# EAGLE design IoTKitV3th (EAGLE 9.2.0)
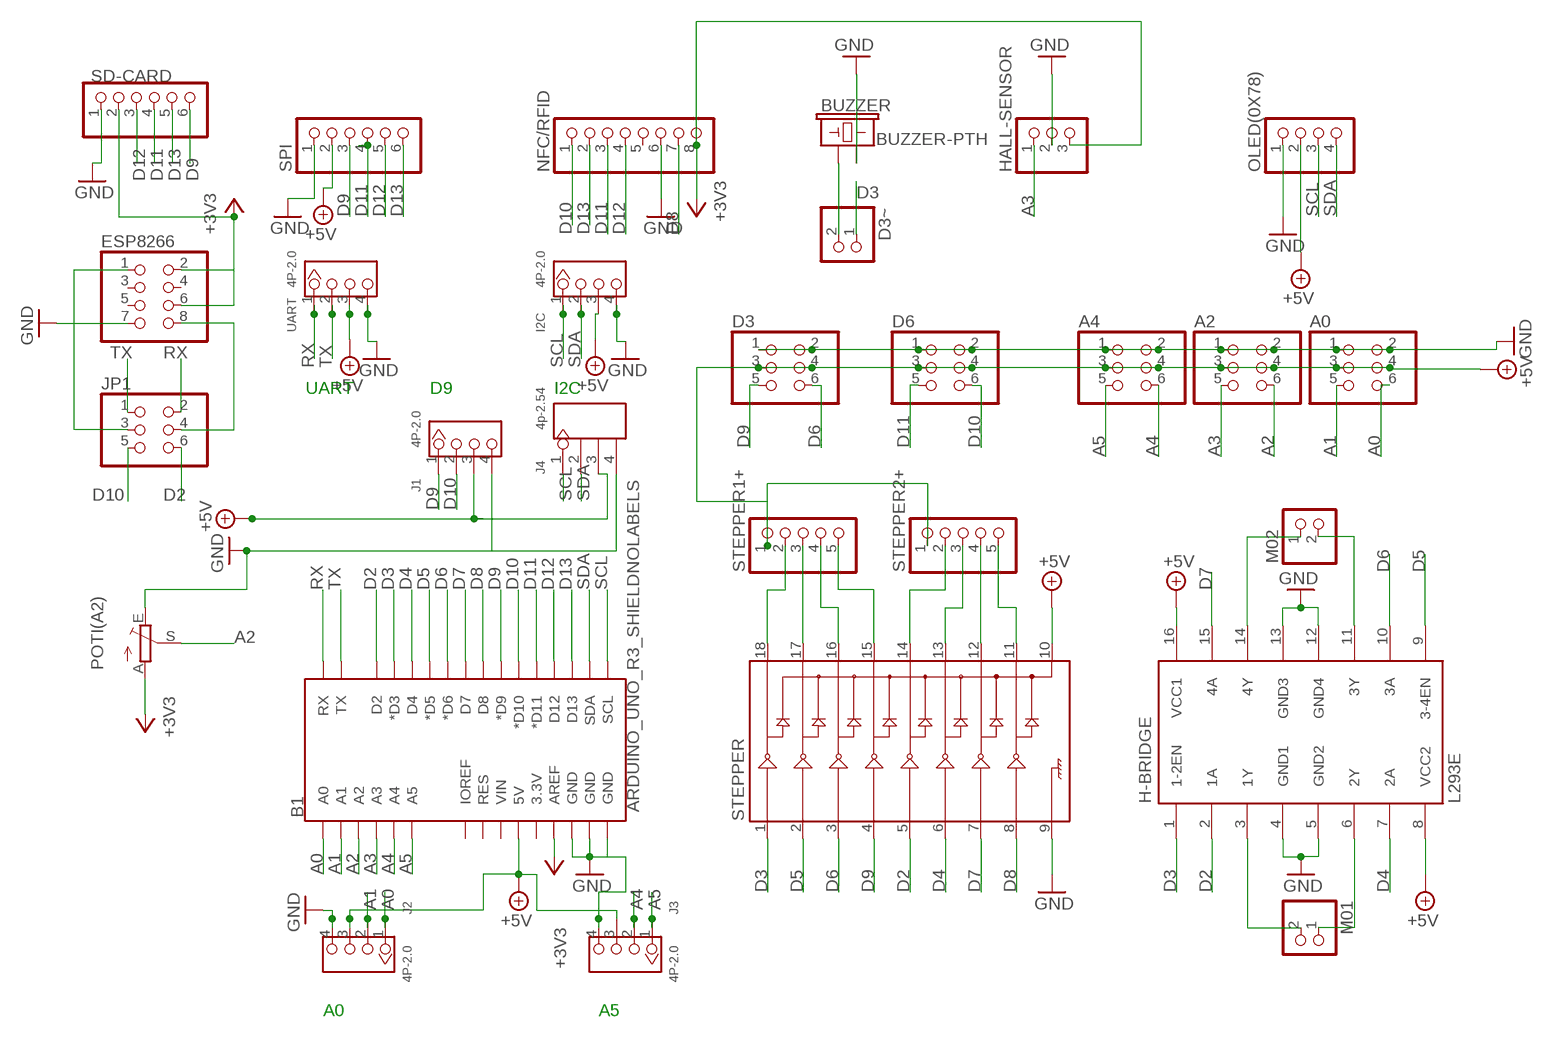
[diagram p0: schematic, sheet 1]

## Parts
A0  PINHD-2X3  [2X03]
A2  PINHD-2X3  [2X03]
A4  PINHD-2X3  [2X03]
B1  ARDUINO_UNO_R3_SHIELDNOLABELS  [UNO_R3_SHIELD_NOLABELS]
BUZZER  BUZZER-PTH  [BUZZER-12MM]
D3  PINHD-2X3  [2X03]
D3~  PINHD-1X2  [1X02]
D6  PINHD-2X3  [2X03]
ESP8266  PINHD-2X4  [2X04]
H-BRIDGE  L293E  [DIL16]
HALL-SENSOR  PINHD-1X3  [1X03]
I2C  4P-2.0  GROVE-CONNECTOR-DIP(4P-2.0)  [HW4-2.0]
J1  4P-2.0  GROVE-CONNECTOR-DIP(4P-2.0)  [HW4-2.0]
J2  4P-2.0  GROVE-CONNECTOR-DIP(4P-2.0)  [HW4-2.0]
J3  4P-2.0  GROVE-CONNECTOR-DIP(4P-2.0)  [HW4-2.0]
J4  4p-2.54  DIP-BLACK-MALE-HEADER-VERT(4P-2.54)  [H4-2.54]
JP1  PINHD-2X3  [2X03]
M01  PINHD-1X2  [1X02]
M02  PINHD-1X2  [1X02]
NFC/RFID  PINHD-1X8  [1X08]
OLED(0X78)  PINHD-1X4  [1X04]
POTI(A2)  TRIM_EU-B25P  [B25P]
SD-CARD  PINHD-1X6  [1X06]
SPI  PINHD-1X6  [1X06]
STEPPER  ULN2803DIP  [DIL18]
STEPPER1+  PINHD-1X5  [1X05]
STEPPER2+  PINHD-1X5  [1X05]
UART  4P-2.0  GROVE-CONNECTOR-DIP(4P-2.0)  [HW4-2.0]

## Nets
+3V3: B1.AREF ESP8266.2 ESP8266.6 HALL-SENSOR.3 NFC/RFID.8 POTI(A2).A SD-CARD.2
+5V: A0.3 A0.4 A2.3 A2.4 A4.3 A4.4 B1.5V D3.3 D3.4 D6.3 D6.4 H-BRIDGE.8(VCC2) H-BRIDGE.16(VCC1) I2C.3 J1.3 J2.3 J3.3 J4.3 OLED(0X78).2 SPI.2 STEPPER1+.1 STEPPER2+.1 STEPPER.10 UART.3
A0: A0.6 B1.A0 J2.1
A1: A0.5 B1.A1 J2.2
A2: A2.6 B1.A2 POTI(A2).S
A3: A2.5 B1.A3 HALL-SENSOR.1
A4: A4.6 B1.A4 J3.2
A5: A4.5 B1.A5 J3.1
D2: B1.D2 H-BRIDGE.2(1A) JP1.6 STEPPER.5
D3: B1.D3(*D3) D3~.1 H-BRIDGE.1(1-2EN) STEPPER.1
D4: B1.D4 H-BRIDGE.7(2A) STEPPER.6
D5: B1.D5(*D5) H-BRIDGE.9(3-4EN) STEPPER.2
D6: B1.D6(*D6) D3.6 H-BRIDGE.10(3A) STEPPER.3
D7: B1.D7 H-BRIDGE.15(4A) STEPPER.7
D8: B1.D8 NFC/RFID.7 STEPPER.8
D9: B1.D9(*D9) D3.5 J1.1 SD-CARD.6 SPI.3 STEPPER.4
D10: B1.D10(*D10) D6.6 J1.2 JP1.5 NFC/RFID.1
D11: B1.D11(*D11) D6.5 NFC/RFID.3 SD-CARD.4 SPI.4
D12: B1.D12 NFC/RFID.4 SD-CARD.3 SPI.5
D13: B1.D13 NFC/RFID.2 SD-CARD.5 SPI.6
GND: A0.1 A0.2 A2.1 A2.2 A4.1 A4.2 B1.GND@0(GND) B1.GND@1(GND) B1.GND@2(GND) BUZZER.- D3.1 D3.2 D6.1 D6.2 ESP8266.7 H-BRIDGE.4(GND1) H-BRIDGE.5(GND2) H-BRIDGE.12(GND4) H-BRIDGE.13(GND3) HALL-SENSOR.2 I2C.4 J1.4 J2.4 J3.4 J4.4 NFC/RFID.6 OLED(0X78).1 POTI(A2).E SD-CARD.1 SPI.1 STEPPER.9 UART.4
M01: H-BRIDGE.6(2Y) M01.1
N$1: STEPPER2+.2 STEPPER.14
N$2: STEPPER2+.3 STEPPER.13
N$3: STEPPER2+.4 STEPPER.12
N$4: STEPPER2+.5 STEPPER.11
N$5: BUZZER.+ D3~.2
N$8: ESP8266.1 JP1.3
N$9: ESP8266.8 JP1.4
N$30: STEPPER1+.2 STEPPER.18
N$31: STEPPER1+.3 STEPPER.17
N$32: STEPPER1+.4 STEPPER.16
N$33: STEPPER1+.5 STEPPER.15
N$38: H-BRIDGE.14(4Y) M02.1
N$39: H-BRIDGE.11(3Y) M02.2
N$40: H-BRIDGE.3(1Y) M01.2
RX: B1.RX JP1.2 UART.1
SCL: B1.SCL I2C.1 J4.1 OLED(0X78).3
SDA: B1.SDA I2C.2 J4.2 OLED(0X78).4
TX: B1.TX JP1.1 UART.2
Unconnected: B1.3.3V B1.IOREF B1.RES B1.VIN ESP8266.3 ESP8266.4 ESP8266.5 NFC/RFID.5

## Notes on the sheet
- UART | D9 | I2C
- A0 | A5

## Library data of the parts
A0 A2 A4 D3 D6 JP1 = pinhead:PINHD-2X3: PIN HEADER
B1 = SparkFun-Boards:ARDUINO_UNO_R3_SHIELD: Arduino R3 Shield Footprint Shield form compatible with the Arduino Uno R3. SparkFun Products: MG2639 Cellular Shield <https://www.sparkfun.com/products/13120> MIDI Shield <https://www.sparkfun.com/products/12898> R3 Stackable Headers Kit <https://www.sparkfun.com/products/11417>
BUZZER = SparkFun-Electromechanical:BUZZER: Buzzer Small round buzzers that operate around the audible 2kHz range. You can use these as speakers to create simple music or user interfaces. Variant Overview: PTH - Mini Speaker - PC Mount 12mm 2.048kHz <https://www.sparkfun.com/products/7950> PTH_KIT - Mini Speaker - PC Mount 12mm 2.048kHz <https://www.sparkfun.com/products/7950> KIT simplifies soldering by adding stop mask to one side of the pads. PTH_NO_SILK - Mini Speaker - PC Mount 12mm 2.048kHz <https://www.sparkfun.com/products/7950> No silkscreen indicator of buzzer outline. PTH_KIT_NO_SILK - Mini Speaker - PC Mount 12mm 2.048kHz <https://www.sparkfun.com/products/7950> KIT package w/o silkscreen SMD - Buzzer Audio Magnetic (CCV-084B16) SMD buzzer used on, e.g. the LilyPad Buzzer <https://www.sparkfun.com/products/8463> and RFID USB Reader <https://www.sparkfun.com/products/9963>. SMD_KIT - Buzzer Audio Magnetic (CCV-084B16) SMD Buzzer with elongated pins to make soldering easier. Used on the SparkFun Simon Says - Surface Mount Soldering Kit <https://www.sparkfun.com/products/10935>.; PROD_ID: COMP-08253; SF_SKU: COM-07950
D3~ M01 M02 = pinhead:PINHD-1X2: PIN HEADER
ESP8266 = pinhead:PINHD-2X4: PIN HEADER
H-BRIDGE = texas:L293E: TI DEVICE; MF: Arrow Electronics; MPN: L293E; OC_FARNELL: 1467711; OC_NEWARK: 89K0732
HALL-SENSOR = pinhead:PINHD-1X3: PIN HEADER
I2C J1-J3 UART = Seeed-Connector:GROVE-CONNECTOR-DIP(4P-2.0): 320110033
J4 = Seeed-Connector:DIP-BLACK-MALE-HEADER-VERT(4P-2.54): 320020017; MPN: P125-1104A0BS116A1
NFC/RFID = pinhead:PINHD-1X8: PIN HEADER
OLED(0X78) = pinhead:PINHD-1X4: PIN HEADER
POTI(A2) = pot:TRIM_EU-: POTENTIOMETER
SD-CARD SPI = pinhead:PINHD-1X6: PIN HEADER
STEPPER = SparkFun-IC-Special-Function:ULN2803: Darlington Driver(IC-07959, low stock) ULN2803 Darlington array. 500mA max per channel, 8-channel package. Spark Fun Electronics SKU : COM-00312
STEPPER1+ STEPPER2+ = pinhead:PINHD-1X5: PIN HEADER

## Board
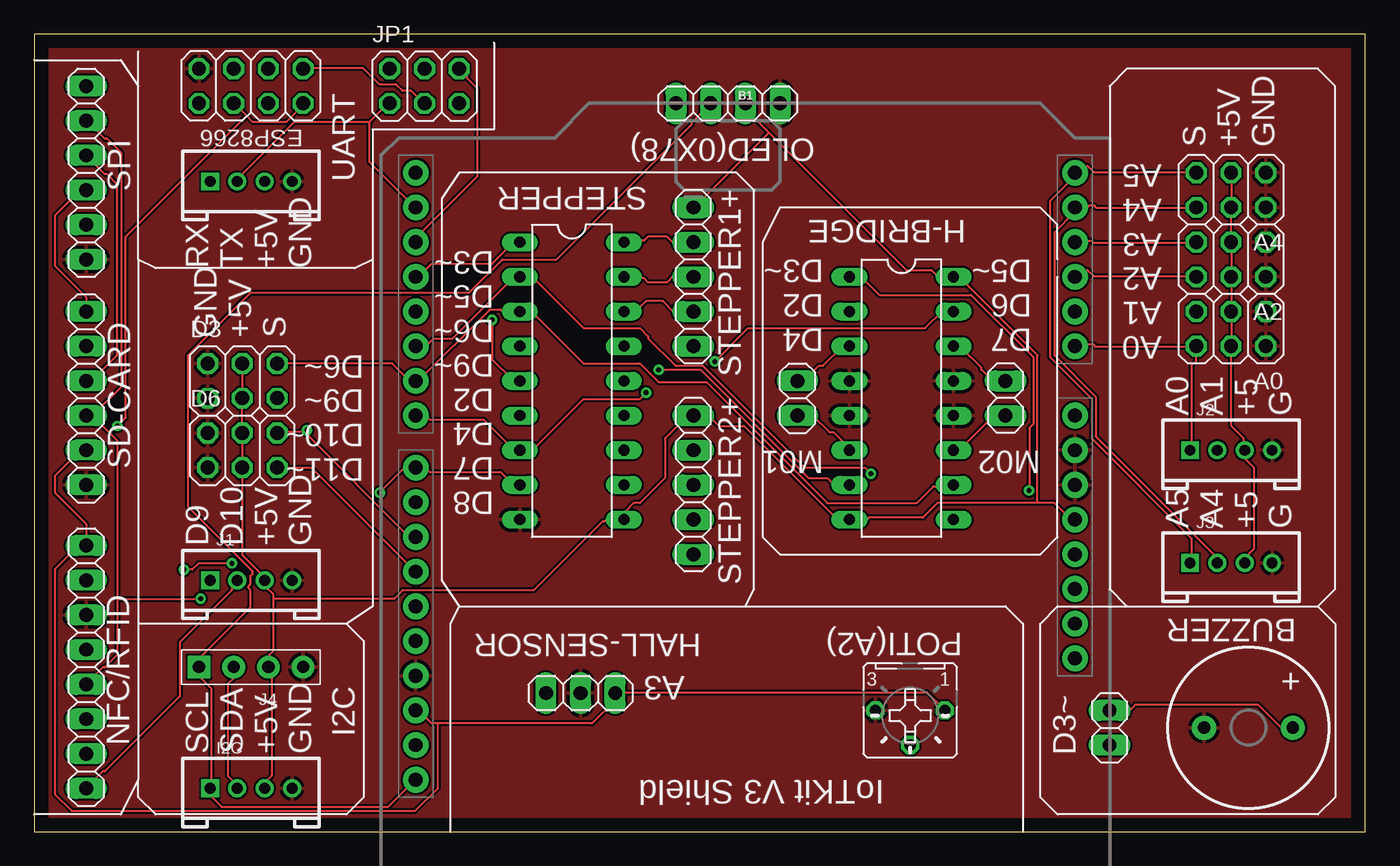
[diagram p1: board, top side]
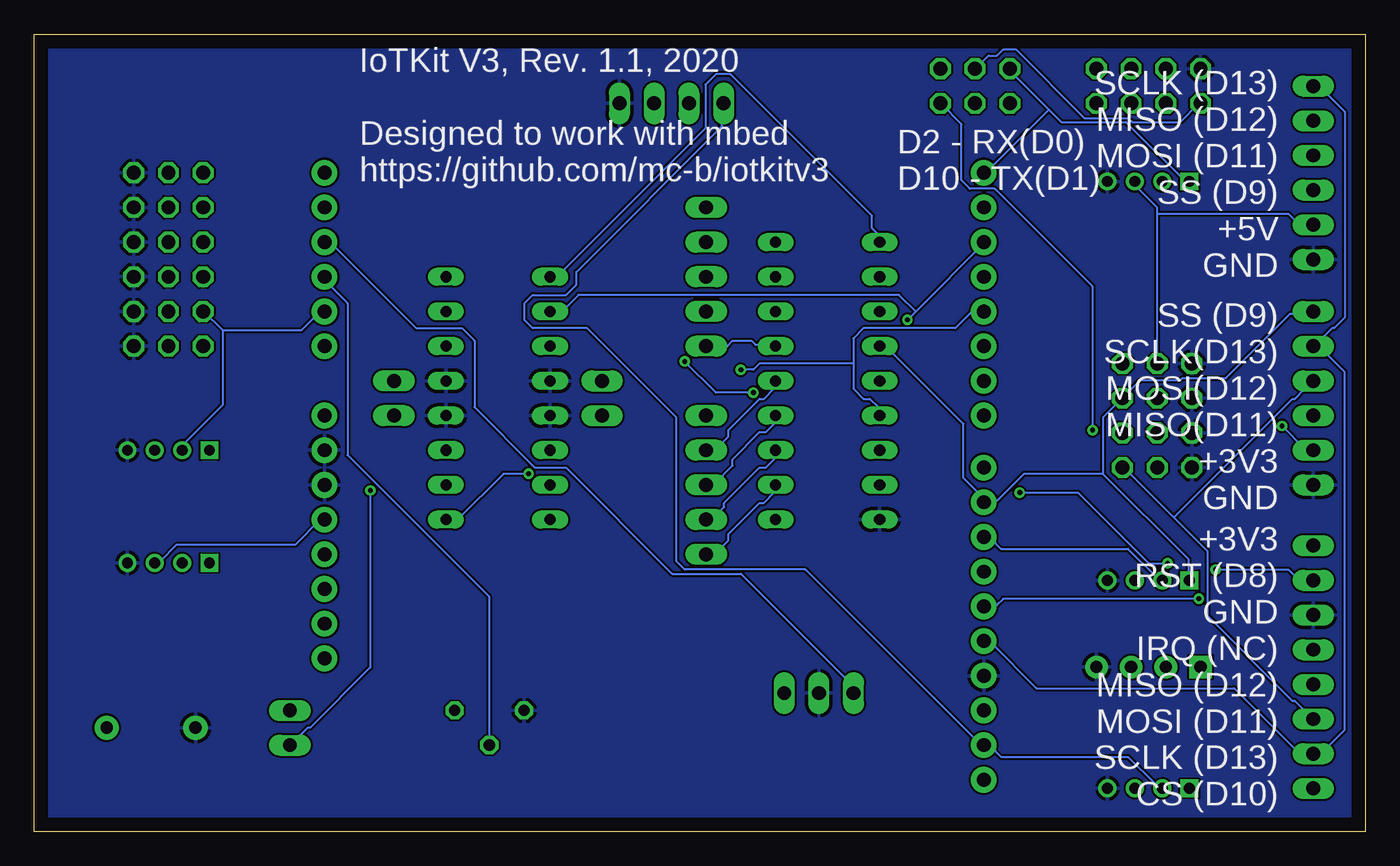
[diagram p2: board, bottom side, seen from below]

Size 97.46 x 58.41 mm. Coordinates in mm from the lower left corner, seen from the top.
Outline: 0,0 97.46,0 97.46,58.41 0,58.41 0,0
Copper layers (1*16): Top 0.035mm / dielectric 1.5mm / Bottom 0.035mm
Design rules "default": minimum track width 6mil, minimum drill 0.35mm, track to track 6mil, track to pad 6mil, pad to pad 6mil, via to via 6mil, smd to smd 6mil, copper to edge 40mil, drill to drill 6mil, minimum pad ring 10mil, minimum via ring 8mil, stop-mask expansion 4mil, vias tented up to drill 0mil, thermal gap 10mil

### Footprints (pad centres in the part's own frame; a part is rotated, then mirrored left to right if it is on the bottom)
2X03 = drill 1.016 octagon: 1 -2.54,-1.27; 2 -2.54,1.27; 3 0,-1.27; 4 0,1.27; 5 2.54,-1.27; 6 2.54,1.27
UNO_R3_SHIELD_NOLABELS = drill 1.016 pad 1.88: 3.3V 24.13,-3.81; 5V 24.13,-1.27; A0 24.13,11.43; A1 24.13,13.97; A2 24.13,16.51; A3 24.13,19.05; A4 24.13,21.59; A5 24.13,24.13; AREF -24.13,-15.24; D2 -24.13,19.05; D3 -24.13,16.51; D4 -24.13,13.97; D5 -24.13,11.43; D6 -24.13,8.89; D7 -24.13,6.35; D8 -24.13,2.54; D9 -24.13,0; D10 -24.13,-2.54; D11 -24.13,-5.08; D12 -24.13,-7.62; D13 -24.13,-10.16; GND@0 24.13,1.27; GND@1 24.13,3.81; GND@2 -24.13,-12.7; IOREF 24.13,-8.89; NC 24.13,-11.43; RES 24.13,-6.35; RX -24.13,24.13; SCL -24.13,-20.32; SDA -24.13,-17.78; TX -24.13,21.59; VIN 24.13,6.35
BUZZER-12MM = drill 0.9 pad 1.778: + 3.25,0; - -3.25,0
1X02 = drill 1.016 long: 1 -1.27,0; 2 1.27,0
2X04 = drill 1.016 octagon: 1 -3.81,-1.27; 2 -3.81,1.27; 3 -1.27,-1.27; 4 -1.27,1.27; 5 1.27,-1.27; 6 1.27,1.27; 7 3.81,-1.27; 8 3.81,1.27
DIL16 = drill 0.813 long: 1 -8.89,-3.81; 2 -6.35,-3.81; 3 -3.81,-3.81; 4 -1.27,-3.81; 5 1.27,-3.81; 6 3.81,-3.81; 7 6.35,-3.81; 8 8.89,-3.81; 9 8.89,3.81; 10 6.35,3.81; 11 3.81,3.81; 12 1.27,3.81; 13 -1.27,3.81; 14 -3.81,3.81; 15 -6.35,3.81; 16 -8.89,3.81
1X03 = drill 1.016 long: 1 -2.54,0; 2 0,0; 3 2.54,0
HW4-2.0 = drill 0.8 pad 1.27 square: 1 -3,0 | drill 0.8 pad 1.27: 2 -1,0; 3 1,0; 4 3,0
H4-2.54 = drill 0.889 pad 1.651 square: 1 0,3.81 | drill 0.889 pad 1.651: 2 0,1.27; 3 0,-1.27; 4 0,-3.81
1X08 = drill 1.016 long: 1 -8.89,0; 2 -6.35,0; 3 -3.81,0; 4 -1.27,0; 5 1.27,0; 6 3.81,0; 7 6.35,0; 8 8.89,0
1X04 = drill 1.016 long: 1 -3.81,0; 2 -1.27,0; 3 1.27,0; 4 3.81,0
B25P = drill 0.813 octagon: A -2.54,0; E 2.54,0; S 0,2.54
1X06 = drill 1.016 long: 1 -6.35,0; 2 -3.81,0; 3 -1.27,0; 4 1.27,0; 5 3.81,0; 6 6.35,0
DIL18 = drill 0.813 long: 1 -10.16,-3.81; 2 -7.62,-3.81; 3 -5.08,-3.81; 4 -2.54,-3.81; 5 0,-3.81; 6 2.54,-3.81; 7 5.08,-3.81; 8 7.62,-3.81; 9 10.16,-3.81; 10 10.16,3.81; 11 7.62,3.81; 12 5.08,3.81; 13 2.54,3.81; 14 0,3.81; 15 -2.54,3.81; 16 -5.08,3.81; 17 -7.62,3.81; 18 -10.16,3.81
1X05 = drill 1.016 long: 1 -5.08,0; 2 -2.54,0; 3 0,0; 4 2.54,0; 5 5.08,0

### Placement (x,y rotation side)
A0  87.63,36.83 180 top
A2  87.63,41.91 180 top
A4  87.63,46.99 180 top
B1  52.07,24.13 0 top
BUZZER  88.9,7.62 0 top
D3  15.24,33.02 0 top
D3~  78.74,7.62 90 top
D6  15.24,27.94 0 top
ESP8266  15.88,54.61 180 top
H-BRIDGE  63.5,31.75 270 top
HALL-SENSOR  40.01,10.16 0 top
I2C  15.88,3.17 0 top
J1  15.88,18.41 0 top
J2  87.63,27.94 0 top
J3  87.63,19.68 0 top
J4  15.88,12.06 90 top
JP1  28.57,54.61 0 top
M01  55.88,31.75 90 top
M02  71.12,31.75 270 top
NFC/RFID  3.81,12.06 90 top
OLED(0X78)  50.8,53.34 180 top
POTI(A2)  64.14,8.89 180 top
SD-CARD  3.81,31.75 90 top
SPI  3.81,48.26 90 top
STEPPER  39.37,33.02 270 top
STEPPER1+  48.26,40.64 270 top
STEPPER2+  48.26,25.4 270 top
UART  15.88,47.62 0 top

### Tracks (layer width: path | path; a pad name or v marks a point on that pad's centre or on a via)
+3V3  (via drill 0.35)
  Top 0.152: POTI(A2).A 66.6,8.99 65.38,10.21 42.67,10.21 HALL-SENSOR.3 42.52,10.06 42.52,9.6 40.84,7.92 29.57,7.92 | 29.57,7.92 29.11,7.92 28.65,8.38 28.5,8.38 28.04,8.84 B1.AREF | 15.54,52.43 16,51.97 18.44,51.97 19.81,53.34 ESP8266.2 | 15.54,52.43 14.63,53.34 ESP8266.6 | SD-CARD.2 3.81,27.89 3.35,27.89 1.52,26.06 1.52,24.84 3.81,22.55 NFC/RFID.8 3.81,20.88 3.2,20.88 1.52,19.2 1.52,2.74 2.74,1.52 27.89,1.52 29.57,3.2 29.57,7.92 | 15.54,52.43 6.71,43.59 6.71,30.33 v6.1,29.72
  Bottom 0.152: v6.1,29.72 4.42,28.04 3.81,28.04 SD-CARD.2
+5V
  Top 0.152: I2C.3 16.92,3.2 16.92,3.66 17.37,4.12 17.37,11.89 17.22,12.04 J4.3 17.22,12.19 17.22,12.95 17.53,13.26 17.53,17.07 | 17.53,17.07 17.53,17.37 16.92,17.98 16.92,18.29 J1.3 16.76,18.44 16.76,18.75 15.24,20.27 D6.3 D6.4 D3.3 D3.4 | 53.8,51.21 52.12,52.88 52.12,53.34 OLED(0X78).2 | 53.8,51.21 63.86,41.15 65.68,41.15 66.14,40.69 67.21,40.69 H-BRIDGE.16 67.36,40.54 67.82,40.54 73.46,34.9 73.46,24.08 | 53.8,51.21 48.31,45.72 STEPPER1+.1 | A4.3 A4.4 A2.3 A2.4 A0.3 A0.4 87.63,29.72 88.54,28.8 88.54,28.04 J2.3 88.7,27.89 88.7,27.28 89.31,26.67 89.31,20.73 88.7,20.12 88.7,19.81 J3.3 | 73.46,24.08 74.68,24.08 75.89,22.86 B1.5V | 73.46,24.08 66.14,24.08 65.08,23.01 61.11,23.01 60.96,22.86 H-BRIDGE.8 58.83,22.86 51.97,29.72 50.14,29.72 49.38,30.48 STEPPER2+.1 47.85,30.48 46.18,28.8 46.18,25.91 44.35,24.08 43.89,24.08 43.28,23.47 43.28,22.86 STEPPER.10 41.91,22.86 41.76,22.71 41.6,22.71 36.58,17.68 26.98,17.68 26.36,17.07 17.53,17.07
  Bottom 0.152: D3.4 15.24,45.26 | 15.24,45.26 15.24,45.72 16.76,47.24 16.76,47.55 UART.3 | 15.24,45.26 5.64,45.26 4.88,44.5 3.81,44.5 SPI.2 | B1.5V 76.5,22.86 78.33,21.03 87.02,21.03 88.24,19.81 88.54,19.81 J3.3
A0
  Top 0.152: 85.04,35.51 85.04,34.44 84.73,34.14 84.73,28.04 J2.1 | 85.04,35.51 77.72,35.51 77.57,35.66 76.2,35.66 B1.A0 | 85.04,35.51 A0.6
A1
  Bottom 0.152: 83.67,36.73 83.67,31.24 86.56,28.35 86.56,28.04 J2.2 | 83.67,36.73 85.04,38.1 A0.5 | B1.A1 76.5,38.1 77.88,36.73 83.67,36.73
A2
  Top 0.152: A2.6 85.04,40.69 77.57,40.69 77.11,41.15 76.66,40.69 76.2,40.69 B1.A2
  Bottom 0.152: B1.A2 76.2,40.39 74.52,38.71 74.52,27.58 64.16,17.22 64.16,6.4 POTI(A2).S
A3
  Top 0.152: A2.5 85.04,43.13 77.57,43.13 77.42,43.28 76.2,43.28 B1.A3
  Bottom 0.152: HALL-SENSOR.1 37.49,10.21 37.49,10.67 45.72,18.9 50.75,18.9 58.52,26.67 60.81,26.67 65.23,31.09 65.23,35.97 66.14,36.88 69.49,36.88 75.74,43.13 76.2,43.13 B1.A3
A4
  Top 0.152: J3.2 86.56,19.81 86.56,20.12 77.72,28.96 77.72,31.85 74.68,34.9 74.68,43.89 76.2,45.41 B1.A4 77.11,45.72 77.27,45.87 77.57,45.87 77.72,45.72 A4.6
A5
  Top 0.152: J3.1 84.73,19.81 84.73,21.49 77.42,28.8 77.42,31.7 74.37,34.75 74.37,46.18 76.2,48.01 B1.A5 76.2,48.31 76.66,48.31 77.11,48.77 77.57,48.31 85.04,48.31 A4.5
D2  (via drill 0.35)
  Top 0.152: v33.53,37.49 33.53,34.59 35.05,33.07 35.51,33.07 STEPPER.5 | JP1.6 31.24,55.78 31.7,55.32 31.7,55.17 32.46,54.41 32.46,48.01 28.04,43.59 28.04,43.28 B1.D2
  Bottom 0.152: 32.92,38.1 27.89,43.13 B1.D2 | 32.92,38.1 v33.53,37.49 | H-BRIDGE.2 58.83,38.1 57.61,39.32 34.14,39.32 32.92,38.1
D3  (via drill 0.35)
  Top 0.152: STEPPER.1 35.51,43.13 35.05,43.13 33.53,41.6 29.11,41.6 28.04,40.54 B1.D3 | v72.85,24.99 72.85,29.57 73.15,29.87 73.15,34.75 68.58,39.32 61.87,39.32 60.66,40.54 59.74,40.54 H-BRIDGE.1
  Bottom 0.152: H-BRIDGE.1 59.59,40.69 59.13,40.69 48.31,51.51 48.31,54.71 47.55,55.47 46.48,55.47 36.12,45.11 36.12,44.2 35.66,43.74 35.66,43.28 STEPPER.1 | v72.85,24.99 72.85,12.04 77.27,7.62 77.42,7.62 78.64,6.4 D3~.1
D4  (via drill 0.35)
  Top 0.152: v45.72,33.83 48.77,33.83 56.69,25.91 58.06,25.91 58.52,25.45 59.59,25.45 H-BRIDGE.7
  Bottom 0.152: 37.49,34.29 37.49,36.12 36.73,36.88 30.02,36.88 28.8,38.1 B1.D4 | 37.49,34.29 37.49,32.46 36.73,31.7 36.27,31.7 35.66,31.09 35.66,30.48 STEPPER.6 | v45.72,33.83 44.81,33.83 44.35,34.29 37.49,34.29
D5  (via drill 0.35)
  Top 0.152: B1.D5 28.04,35.66 28.8,35.66 29.26,36.12 30.63,36.12 35.05,40.54 35.51,40.54 STEPPER.2 35.66,40.54 36.58,40.54 40.23,36.88 44.35,36.88 44.96,36.27 44.96,36.12 46.94,34.14 48.92,34.14 56.39,26.67 60.81,26.67 v61.27,26.21
  Bottom 0.152: H-BRIDGE.9 66.45,22.86 63.09,26.21 v61.27,26.21
D6
  Top 0.152: H-BRIDGE.10 67.21,25.3 65.84,25.3 64.62,24.08 58.06,24.08 49.23,32.92 45.72,32.92 44.35,34.29 40.23,34.29 36.42,38.1 STEPPER.3 34.29,38.1 34.14,38.25 33.38,38.25 28.04,32.92 B1.D6 27.89,33.07 27.43,33.07 26.21,34.29 D3.6
D7  (via drill 0.35)
  Top 0.152: B1.D7 28.65,30.48 28.96,30.18 32.92,30.18 35.05,28.04 35.51,28.04 STEPPER.7 35.66,28.04 36.58,28.04 40.23,31.7 44.35,31.7 v44.81,32.16 | H-BRIDGE.15 66.45,38.1 65.23,36.88 52.27,36.88 v49.84,34.44
  Bottom 0.152: v49.84,34.44 47.55,32.16 v44.81,32.16
D8  (via drill 0.35)
  Top 0.152: STEPPER.8 35.51,25.45 35.05,25.45 34.14,26.36 28.96,26.36 28.65,26.67 B1.D8 27.13,26.67 v25.3,24.84 | v10.97,19.2 11.58,19.2 12.04,19.66 v14.48,19.66
  Bottom 0.152: v10.97,19.2 5.64,19.2 4.88,18.44 3.81,18.44 NFC/RFID.7 | v14.48,19.66 15.85,19.66 21.03,24.84 v25.3,24.84
D9
  Top 0.152: SD-CARD.6 3.81,39.17 1.52,41.45 1.52,45.11 3.35,46.94 3.81,46.94 SPI.3
  Bottom 0.152: STEPPER.4 35.51,35.51 35.05,35.51 29.41,29.87 29.41,25.91 28.04,24.54 28.04,24.23 B1.D9 27.89,24.23 26.98,24.23 24.99,26.21 19.2,26.21 | 19.2,26.21 12.95,19.96 12.95,18.44 J1.1 | 19.2,26.21 19.2,30.33 D3.5 16.46,33.07 13.56,33.07 13.41,33.22 10.21,33.22 5.49,37.95 5.33,37.95 5.18,38.1 SD-CARD.6
D10  (via drill 0.35)
  Top 0.152: NFC/RFID.1 3.81,3.2 5.03,4.42 5.18,4.42 10.67,9.91 10.67,13.87 14.48,17.68 14.48,17.83 14.94,18.29 J1.2 | 19.81,29.26 17.83,29.26 D6.6 | 19.81,29.26 27.43,21.64 27.89,21.64 B1.D10 | 19.81,29.26 v19.96,29.41
  Bottom 0.152: J1.2 14.94,18.44 15.24,18.75 15.39,18.75 17.37,20.73 26.67,20.73 27.43,21.49 27.89,21.49 B1.D10 | v19.96,29.41 19.96,39.93 27.13,47.09 28.96,47.09 29.57,47.7 29.57,51.82 31.09,53.34 JP1.5
D11
  Top 0.152: SPI.4 5.18,48.16 5.33,48.16 6.1,47.4 6.1,34.9 4.27,33.07 3.81,33.07 SD-CARD.4 | D6.5 20.27,26.67 27.89,19.05 B1.D11
  Bottom 0.152: 14.02,23.01 17.68,26.67 D6.5 | 14.02,23.01 11.58,20.57 11.58,15.85 5.33,9.6 5.18,9.6 4.42,8.84 4.27,8.84 3.81,8.38 NFC/RFID.3 | 14.02,23.01 5.33,31.7 5.18,31.7 4.42,32.46 4.27,32.46 3.81,32.92 SD-CARD.4
D12  (via drill 0.35)
  Top 0.152: 6.1,17.07 6.1,28.65 4.27,30.48 | 6.1,17.07 6.1,12.95 5.18,12.04 5.03,12.04 3.81,10.82 NFC/RFID.4 | 4.27,30.48 6.4,32.61 6.4,49.68 5.33,50.75 5.18,50.75 4.42,51.51 4.27,51.51 3.81,51.97 SPI.5 | 4.27,30.48 SD-CARD.3 | 6.1,17.07 v12.19,17.07
  Bottom 0.152: v12.19,17.07 26.52,17.07 26.98,16.61 27.89,16.61 B1.D12
D13
  Bottom 0.152: 3.66,35.81 3.35,36.12 3.2,36.12 2.44,36.88 2.29,36.88 1.52,37.64 1.52,52.73 3.35,54.56 3.81,54.56 SPI.6 | 3.66,35.81 3.81,35.66 SD-CARD.5 3.66,35.81 | 3.81,5.79 4.88,5.79 9.6,10.52 24.08,10.52 27.43,13.87 27.89,13.87 B1.D13 | 3.66,35.81 1.52,33.68 1.52,7.47 3.2,5.79 3.81,5.79 | 3.81,5.79 NFC/RFID.2
GND
  pour Bottom: -0.64,59.05 -0.64,-1.27 98.42,-1.27 98.42,59.05
  pour Top: -1.27,59.69 -1.27,-1.91 99.69,-1.91 99.69,59.05 99.06,59.69 -0.64,59.69
M01
  Top 0.152: H-BRIDGE.6 59.13,28.5 59.13,28.65 58.52,29.26 58.22,29.26 57,30.48 M01.1
N$1
  Bottom 0.152: STEPPER.14 43.28,32.92 43.28,32.46 44.04,31.7 44.35,31.7 46.63,29.41 46.63,28.96 47.55,28.04 48.16,28.04 STEPPER2+.2
N$2
  Bottom 0.152: STEPPER.13 43.28,30.48 43.28,29.87 43.89,29.26 44.35,29.26 46.33,27.28 46.33,26.82 47.7,25.45 48.16,25.45 STEPPER2+.3
N$3
  Bottom 0.152: STEPPER2+.4 47.85,22.86 46.94,23.77 46.94,24.08 44.35,26.67 43.89,26.67 43.28,27.28 43.28,27.89 STEPPER.12
N$4
  Bottom 0.152: STEPPER.11 43.28,25.3 43.28,24.84 44.04,24.08 44.35,24.08 46.63,21.79 46.63,21.34 47.55,20.42 48.16,20.42 STEPPER2+.5
N$5
  Top 0.152: BUZZER.+ 91.29,7.62 89.61,9.3 80.62,9.3 80.31,8.99 78.79,8.99 D3~.2
N$8
  Top 0.152: ESP8266.1 19.81,55.93 24.08,55.93 25.3,54.71 26.52,54.71 26.98,54.25 27.58,54.25 28.5,53.34 JP1.3
N$9
  Bottom 0.152: ESP8266.8 12.19,53.34 13.56,51.97 17.07,51.97 17.37,52.27 20.57,52.27 25.6,57.3 26.52,57.3 26.98,56.84 27.58,56.84 28.5,55.93 JP1.4
N$30
  Top 0.152: STEPPER.18 43.28,43.28 44.65,43.28 44.96,43.59 46.33,43.59 46.79,43.13 48.16,43.13 STEPPER1+.2
N$31
  Top 0.152: STEPPER.17 43.28,40.54 44.65,40.54 44.96,40.23 46.33,40.23 46.79,40.69 48.16,40.69 STEPPER1+.3
N$32
  Top 0.152: STEPPER.16 44.04,38.1 44.81,38.86 46.02,38.86 46.79,38.1 STEPPER1+.4
N$33
  Bottom 0.152: STEPPER.15 43.28,35.66 44.65,35.66 44.96,35.97 46.33,35.97 46.79,35.51 48.16,35.51 STEPPER1+.5
N$38
  Top 0.152: H-BRIDGE.14 67.36,35.51 67.82,35.51 69.34,33.98 69.34,33.83 70.1,33.07 71.02,33.07 M02.1
N$39
  Top 0.152: M02.2 70.26,30.48 67.82,28.04 67.36,28.04 H-BRIDGE.11
N$40
  Top 0.152: H-BRIDGE.3 59.59,35.51 59.13,35.51 57.76,34.14 57.45,34.14 56.39,33.07 55.93,33.07 M01.2
RX
  Bottom 0.152: 23.16,52.88 26.06,55.78 JP1.2 | 23.16,52.88 22.25,51.97 17.53,51.97 13.26,47.7 12.95,47.7 UART.1 | B1.RX 27.43,48.77 27.28,48.77 23.16,52.88
SCL
  Top 0.152: OLED(0X78).3 48.16,51.97 48.16,51.82 38.25,41.91 34.29,41.91 31.85,39.47 15.85,39.47 11.28,34.9 11.28,23.77 16,19.05 16,18.9 15.85,18.75 15.85,18.14 15.7,17.98 15.7,17.83 15.85,17.68 15.85,16.46 12.19,12.8 12.19,12.19 J4.1 12.19,12.04 12.19,11.28 12.95,10.52 12.95,3.2 I2C.1 12.95,3.05 12.95,2.59 13.72,1.83 25.91,1.83 27.89,3.81 B1.SCL
SDA
  Top 0.152: I2C.2 14.78,3.2 14.78,3.5 14.17,4.12 14.17,10.82 14.63,11.28 14.63,12.04 J4.2
  Bottom 0.152: OLED(0X78).4 47.09,53.34 47.09,51.66 57.76,41 57.76,40.08 58.52,39.32 60.96,39.32 61.57,38.71 61.57,37.49 60.96,36.88 57,36.88 50.44,30.33 50.44,19.81 49.84,19.2 41,19.2 28.04,6.25 B1.SDA 27.89,6.25 27.43,6.25 26.67,5.49 17.37,5.49 15.39,3.5 15.24,3.5 14.94,3.2 I2C.2
TX
  Top 0.152: 24.54,51.97 19.05,51.97 15.24,48.16 15.24,48.01 14.94,47.7 UART.2 | 24.54,51.97 25.91,53.34 JP1.1 | 24.54,51.97 24.54,49.07 27.89,45.72 B1.TX

### Text on the board
tNames: S / +5V / GND | A0 / A1 / A2 / A3 / A4 / A5 | D8 / D7 / D4 / D2 / D9~ / D6~ / D5~ / D3~ | D4 / D2 / D3~ | D7 / D6 / D5~ | RX / TX / +5V / GND | GND / +5V / S | D11~ / D10~ / D9~ / D6~ | A0 / A1 / +5 / G | A5 / A4 / +5 / G | D9 / D10 / +5V / GND | A3 | + | I2C | SCL / SDA / +5V / GND | IoTKit V3 Shield
bNames: D2 - RX(D0) / D10 - TX(D1) | IoTKit V3, Rev. 1.1, 2020 / / Designed to work with mbed / https://github.com/mc-b/iotkitv3 | SCLK (D13) / MISO (D12) / MOSI (D11) / SS (D9) / +5V / GND | SS (D9) / SCLK(D13) / MOSI(D12) / MISO(D11) / +3V3 / GND | +3V3 / RST (D8) / GND / IRQ (NC) / MISO (D12) / MOSI (D11) / SCLK (D13) / CS (D10)